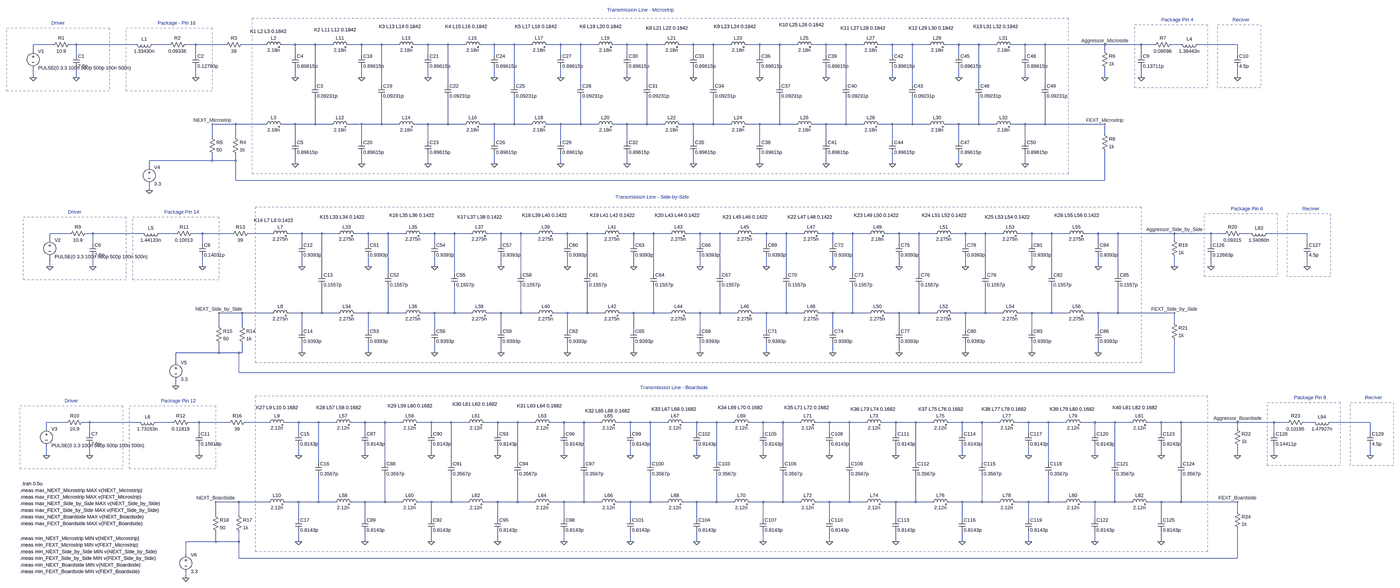
[diagram p0: schematic Assignment 01.asc, whole sheet]
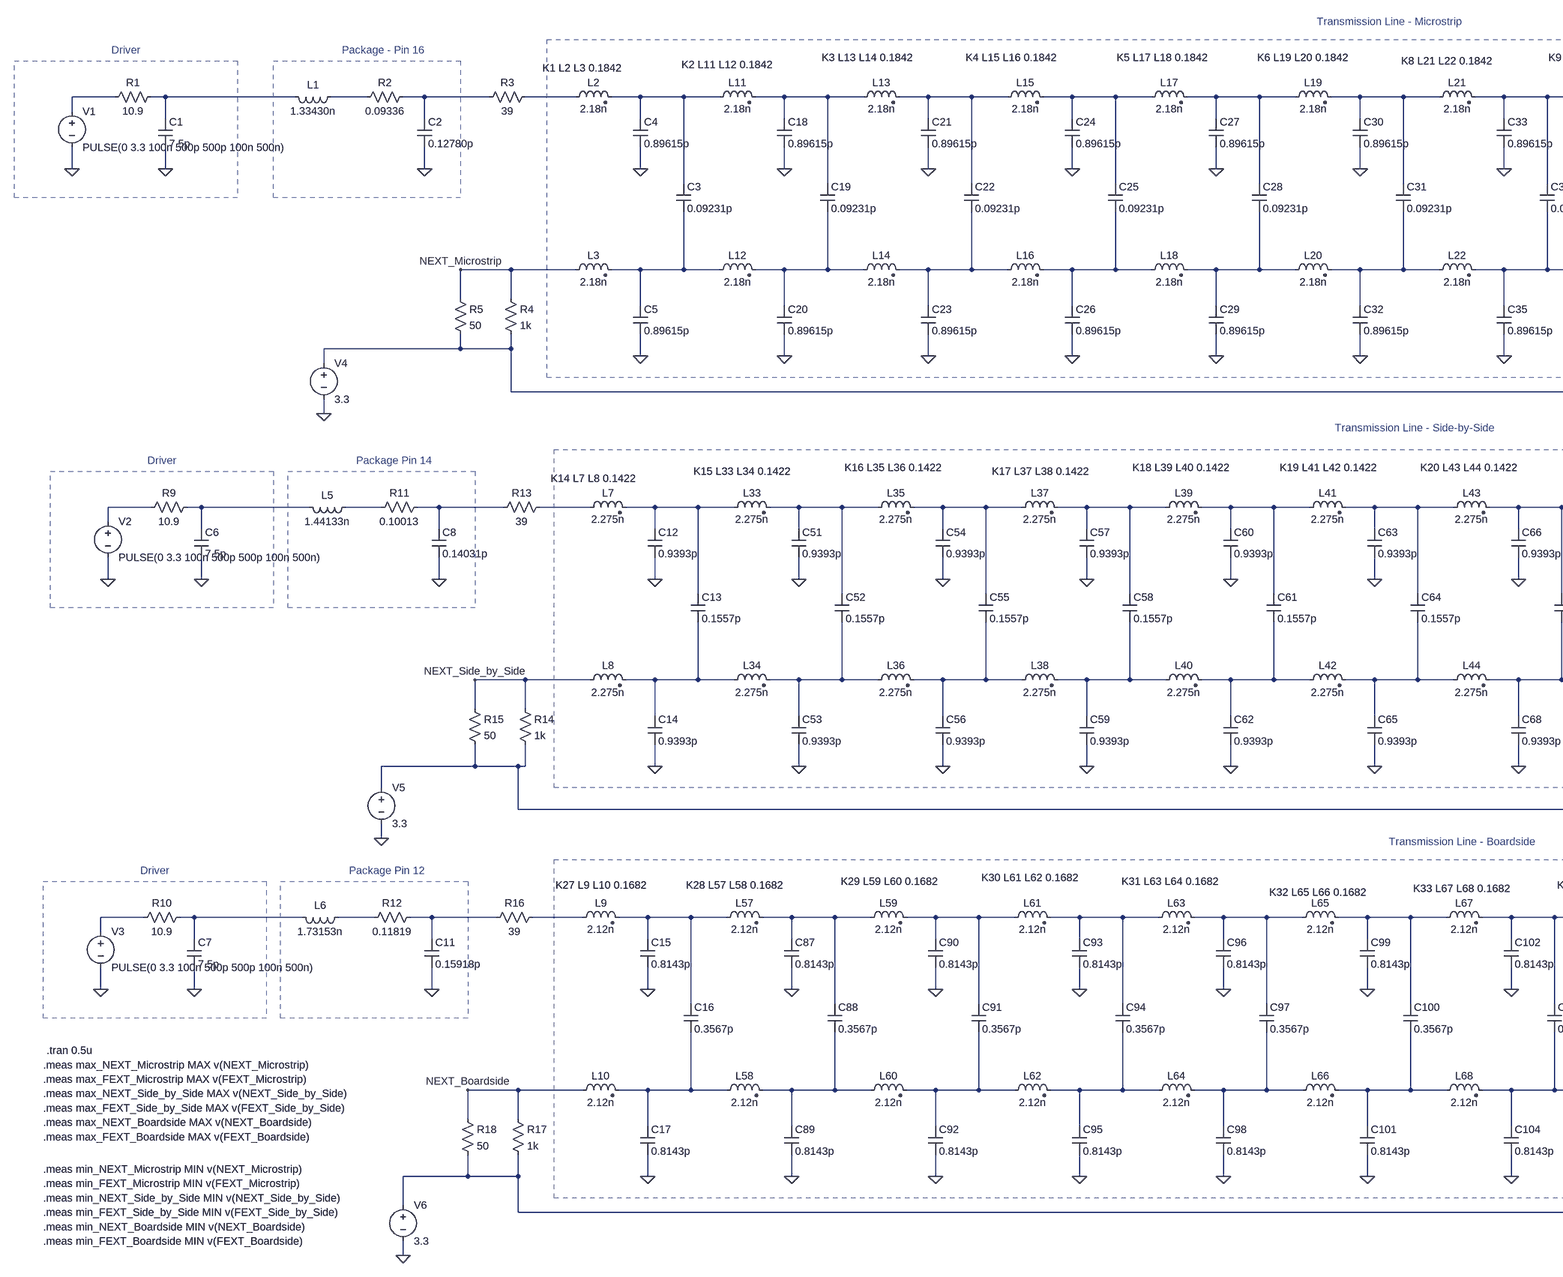
[diagram p1: schematic Assignment 01.asc, part, row 1 of 1, column 1 of 2]
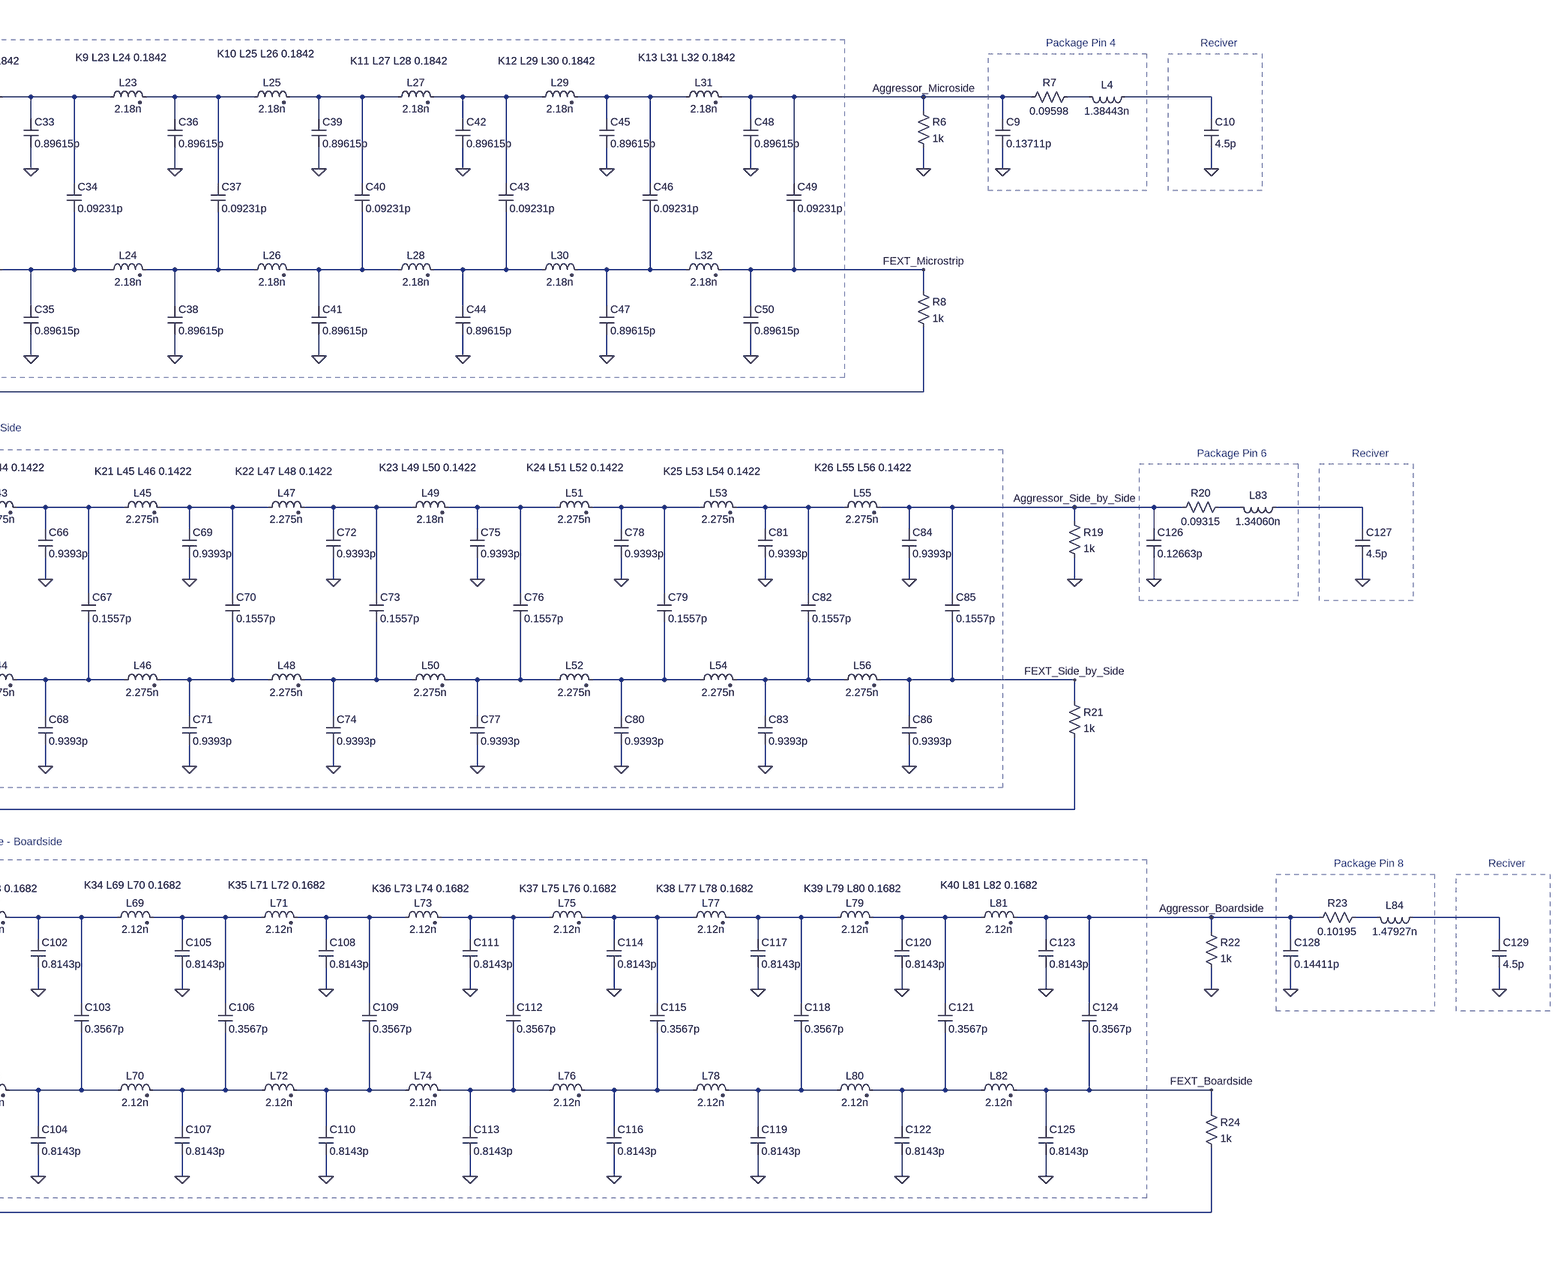
[diagram p2: schematic Assignment 01.asc, part, row 1 of 1, column 2 of 2]
* Assignment 01.asc
R1 N002 N001 10.9
R2 N003 N004 0.09336
C1 N002 0 7.5p
L1 N003 N002 1.33430n
C2 N004 0 0.12780p
R3 N005 N004 39
L2 N005 N006 2.18n
C4 N006 0 0.89615p
C3 N006 N019 0.09231p
C5 N019 0 0.89615p
L3 NEXT_Microstrip N019 2.18n
R4 NEXT_Microstrip N030 1k
R5 NEXT_Microstrip N030 50
R6 Aggressor_Microside 0 1k
R7 N017 Aggressor_Microside 0.09598
L4 N018 N017 1.38443n
C9 Aggressor_Microside 0 0.13711p
C10 N018 0 4.5p
R8 FEXT_Microstrip N030 1k
V2 N031 0 PULSE(0 3.3 100n 500p 500p 100n 500n)
R9 N032 N031 10.9
C6 N032 0 7.5p
R10 N064 N063 10.9
C7 N064 0 7.5p
R11 N033 N034 0.10013
L5 N033 N032 1.44133n
C8 N034 0 0.14031p
R12 N065 N066 0.11819
L6 N065 N064 1.73153n
C11 N066 0 0.15918p
L11 N006 N007 2.18n
C18 N007 0 0.89615p
C19 N007 N020 0.09231p
C20 N020 0 0.89615p
L12 N019 N020 2.18n
L13 N007 N008 2.18n
C21 N008 0 0.89615p
C22 N008 N021 0.09231p
C23 N021 0 0.89615p
L14 N020 N021 2.18n
L15 N008 N009 2.18n
C24 N009 0 0.89615p
C25 N009 N022 0.09231p
C26 N022 0 0.89615p
L16 N021 N022 2.18n
L17 N009 N010 2.18n
C27 N010 0 0.89615p
C28 N010 N023 0.09231p
C29 N023 0 0.89615p
L18 N022 N023 2.18n
L19 N010 N011 2.18n
C30 N011 0 0.89615p
C31 N011 N024 0.09231p
C32 N024 0 0.89615p
L20 N023 N024 2.18n
L21 N011 N012 2.18n
C33 N012 0 0.89615p
C34 N012 N025 0.09231p
C35 N025 0 0.89615p
L22 N024 N025 2.18n
L23 N012 N013 2.18n
C36 N013 0 0.89615p
C37 N013 N026 0.09231p
C38 N026 0 0.89615p
L24 N025 N026 2.18n
L25 N013 N014 2.18n
C39 N014 0 0.89615p
C40 N014 N027 0.09231p
C41 N027 0 0.89615p
L26 N026 N027 2.18n
L27 N014 N015 2.18n
C42 N015 0 0.89615p
C43 N015 N028 0.09231p
C44 N028 0 0.89615p
L28 N027 N028 2.18n
L29 N015 N016 2.18n
C45 N016 0 0.89615p
C46 N016 N029 0.09231p
C47 N029 0 0.89615p
L30 N028 N029 2.18n
L31 N016 Aggressor_Microside 2.18n
C48 Aggressor_Microside 0 0.89615p
C49 Aggressor_Microside FEXT_Microstrip 0.09231p
C50 FEXT_Microstrip 0 0.89615p
L32 N029 FEXT_Microstrip 2.18n
R13 N035 N034 39
L7 N035 N036 2.275n
C12 N036 0 0.9393p
C13 N036 N050 0.1557p
C14 N050 0 0.9393p
L8 NEXT_Side_by_Side N050 2.275n
R14 NEXT_Side_by_Side N062 1k
R15 NEXT_Side_by_Side N062 50
L33 N036 N037 2.275n
C51 N037 0 0.9393p
C52 N037 N051 0.1557p
C53 N051 0 0.9393p
L34 N050 N051 2.275n
L35 N037 N038 2.275n
C54 N038 0 0.9393p
C55 N038 N052 0.1557p
C56 N052 0 0.9393p
L36 N051 N052 2.275n
L37 N038 N039 2.275n
C57 N039 0 0.9393p
C58 N039 N053 0.1557p
C59 N053 0 0.9393p
L38 N052 N053 2.275n
L39 N039 N040 2.275n
C60 N040 0 0.9393p
C61 N040 N054 0.1557p
C62 N054 0 0.9393p
L40 N053 N054 2.275n
L41 N040 N041 2.275n
C63 N041 0 0.9393p
C64 N041 N055 0.1557p
C65 N055 0 0.9393p
L42 N054 N055 2.275n
L43 N041 N042 2.275n
C66 N042 0 0.9393p
C67 N042 N056 0.1557p
C68 N056 0 0.9393p
L44 N055 N056 2.275n
L45 N042 N043 2.275n
C69 N043 0 0.9393p
C70 N043 N057 0.1557p
C71 N057 0 0.9393p
L46 N056 N057 2.275n
L47 N043 N044 2.275n
C72 N044 0 0.9393p
C73 N044 N058 0.1557p
C74 N058 0 0.9393p
L48 N057 N058 2.275n
L49 N044 N045 2.18n
C75 N045 0 0.9393p
C76 N045 N059 0.1557p
C77 N059 0 0.9393p
L50 N058 N059 2.275n
L51 N045 N046 2.275n
C78 N046 0 0.9393p
C79 N046 N060 0.1557p
C80 N060 0 0.9393p
L52 N059 N060 2.275n
L53 N046 N047 2.275n
C81 N047 0 0.9393p
C82 N047 N061 0.1557p
C83 N061 0 0.9393p
L54 N060 N061 2.275n
L55 N047 Aggressor_Side_by_Side 2.275n
C84 Aggressor_Side_by_Side 0 0.9393p
C85 Aggressor_Side_by_Side FEXT_Side_by_Side 0.1557p
C86 FEXT_Side_by_Side 0 0.9393p
L56 N061 FEXT_Side_by_Side 2.275n
R16 N067 N066 39
L9 N067 N068 2.12n
C15 N068 0 0.8143p
C16 N068 N083 0.3567p
C17 N083 0 0.8143p
L10 NEXT_Boardside N083 2.12n
R17 NEXT_Boardside N096 1k
R18 NEXT_Boardside N096 50
L57 N068 N069 2.12n
C87 N069 0 0.8143p
C88 N069 N084 0.3567p
C89 N084 0 0.8143p
L58 N083 N084 2.12n
L59 N069 N070 2.12n
C90 N070 0 0.8143p
C91 N070 N085 0.3567p
C92 N085 0 0.8143p
L60 N084 N085 2.12n
L61 N070 N071 2.12n
C93 N071 0 0.8143p
C94 N071 N086 0.3567p
C95 N086 0 0.8143p
L62 N085 N086 2.12n
L63 N071 N072 2.12n
C96 N072 0 0.8143p
C97 N072 N087 0.3567p
C98 N087 0 0.8143p
L64 N086 N087 2.12n
L65 N072 N073 2.12n
C99 N073 0 0.8143p
C100 N073 N088 0.3567p
C101 N088 0 0.8143p
L66 N087 N088 2.12n
L67 N073 N074 2.12n
C102 N074 0 0.8143p
C103 N074 N089 0.3567p
C104 N089 0 0.8143p
L68 N088 N089 2.12n
L69 N074 N075 2.12n
C105 N075 0 0.8143p
C106 N075 N090 0.3567p
C107 N090 0 0.8143p
L70 N089 N090 2.12n
L71 N075 N076 2.12n
C108 N076 0 0.8143p
C109 N076 N091 0.3567p
C110 N091 0 0.8143p
L72 N090 N091 2.12n
L73 N076 N077 2.12n
C111 N077 0 0.8143p
C112 N077 N092 0.3567p
C113 N092 0 0.8143p
L74 N091 N092 2.12n
L75 N077 N078 2.12n
C114 N078 0 0.8143p
C115 N078 N093 0.3567p
C116 N093 0 0.8143p
L76 N092 N093 2.12n
L77 N078 N079 2.12n
C117 N079 0 0.8143p
C118 N079 N094 0.3567p
C119 N094 0 0.8143p
L78 N093 N094 2.12n
L79 N079 N080 2.12n
C120 N080 0 0.8143p
C121 N080 N095 0.3567p
C122 N095 0 0.8143p
L80 N094 N095 2.12n
L81 N080 Aggressor_Boardside 2.12n
C123 Aggressor_Boardside 0 0.8143p
C124 Aggressor_Boardside FEXT_Boardside 0.3567p
C125 FEXT_Boardside 0 0.8143p
L82 N095 FEXT_Boardside 2.12n
R19 Aggressor_Side_by_Side 0 1k
R20 N048 Aggressor_Side_by_Side 0.09315
L83 N049 N048 1.34060n
C126 Aggressor_Side_by_Side 0 0.12663p
C127 N049 0 4.5p
R21 FEXT_Side_by_Side N062 1k
R22 Aggressor_Boardside 0 1k
R23 N081 Aggressor_Boardside 0.10195
L84 N082 N081 1.47927n
C128 Aggressor_Boardside 0 0.14411p
C129 N082 0 4.5p
R24 FEXT_Boardside N096 1k
V1 N001 0 PULSE(0 3.3 100n 500p 500p 100n 500n)
V3 N063 0 PULSE(0 3.3 100n 500p 500p 100n 500n)
V4 N030 0 3.3
V5 N062 0 3.3
V6 N096 0 3.3
* Driver
* Package - Pin 16
* Package Pin 4
* Reciver
K1 L2 L3 0.1842
* Driver
* Driver
* Package Pin 14
* Package Pin 12
K2 L11 L12 0.1842
K3 L13 L14 0.1842
K4 L15 L16 0.1842
K5 L17 L18 0.1842
K6 L19 L20 0.1842
K8 L21 L22 0.1842
K9 L23 L24 0.1842
K10 L25 L26 0.1842
K11 L27 L28 0.1842
K12 L29 L30 0.1842
K13 L31 L32 0.1842
K14 L7 L8 0.1422
K15 L33 L34 0.1422
K16 L35 L36 0.1422
K17 L37 L38 0.1422
K18 L39 L40 0.1422
K19 L41 L42 0.1422
K20 L43 L44 0.1422
K21 L45 L46 0.1422
K22 L47 L48 0.1422
K23 L49 L50 0.1422
K24 L51 L52 0.1422
K25 L53 L54 0.1422
K26 L55 L56 0.1422
K27 L9 L10 0.1682
K28 L57 L58 0.1682
K29 L59 L60 0.1682
K30 L61 L62 0.1682
K31 L63 L64 0.1682
K32 L65 L66 0.1682
K33 L67 L68 0.1682
K34 L69 L70 0.1682
K35 L71 L72 0.1682
K36 L73 L74 0.1682
K37 L75 L76 0.1682
K38 L77 L78 0.1682
K39 L79 L80 0.1682
K40 L81 L82 0.1682
* Package Pin 6
* Reciver
* Package Pin 8
* Reciver
.tran 0.5u
* Transmission Line - Microstrip
* Transmission Line - Side-by-Side
* Transmission Line - Boardside
.meas max_NEXT_Microstrip MAX v(NEXT_Microstrip)
.meas max_FEXT_Microstrip MAX v(FEXT_Microstrip)
.meas max_NEXT_Side_by_Side MAX v(NEXT_Side_by_Side)
.meas max_FEXT_Side_by_Side MAX v(FEXT_Side_by_Side)
.meas max_NEXT_Boardside MAX v(NEXT_Boardside)
.meas max_FEXT_Boardside MAX v(FEXT_Boardside)
.meas min_NEXT_Microstrip MIN v(NEXT_Microstrip)
.meas min_FEXT_Microstrip MIN v(FEXT_Microstrip)
.meas min_NEXT_Side_by_Side MIN v(NEXT_Side_by_Side)
.meas min_FEXT_Side_by_Side MIN v(FEXT_Side_by_Side)
.meas min_NEXT_Boardside MIN v(NEXT_Boardside)
.meas min_FEXT_Boardside MIN v(FEXT_Boardside)
.backanno
.end